# EAGLE design Line_Finder_Card (EAGLE 6.4)

## Sheet 1 of 2
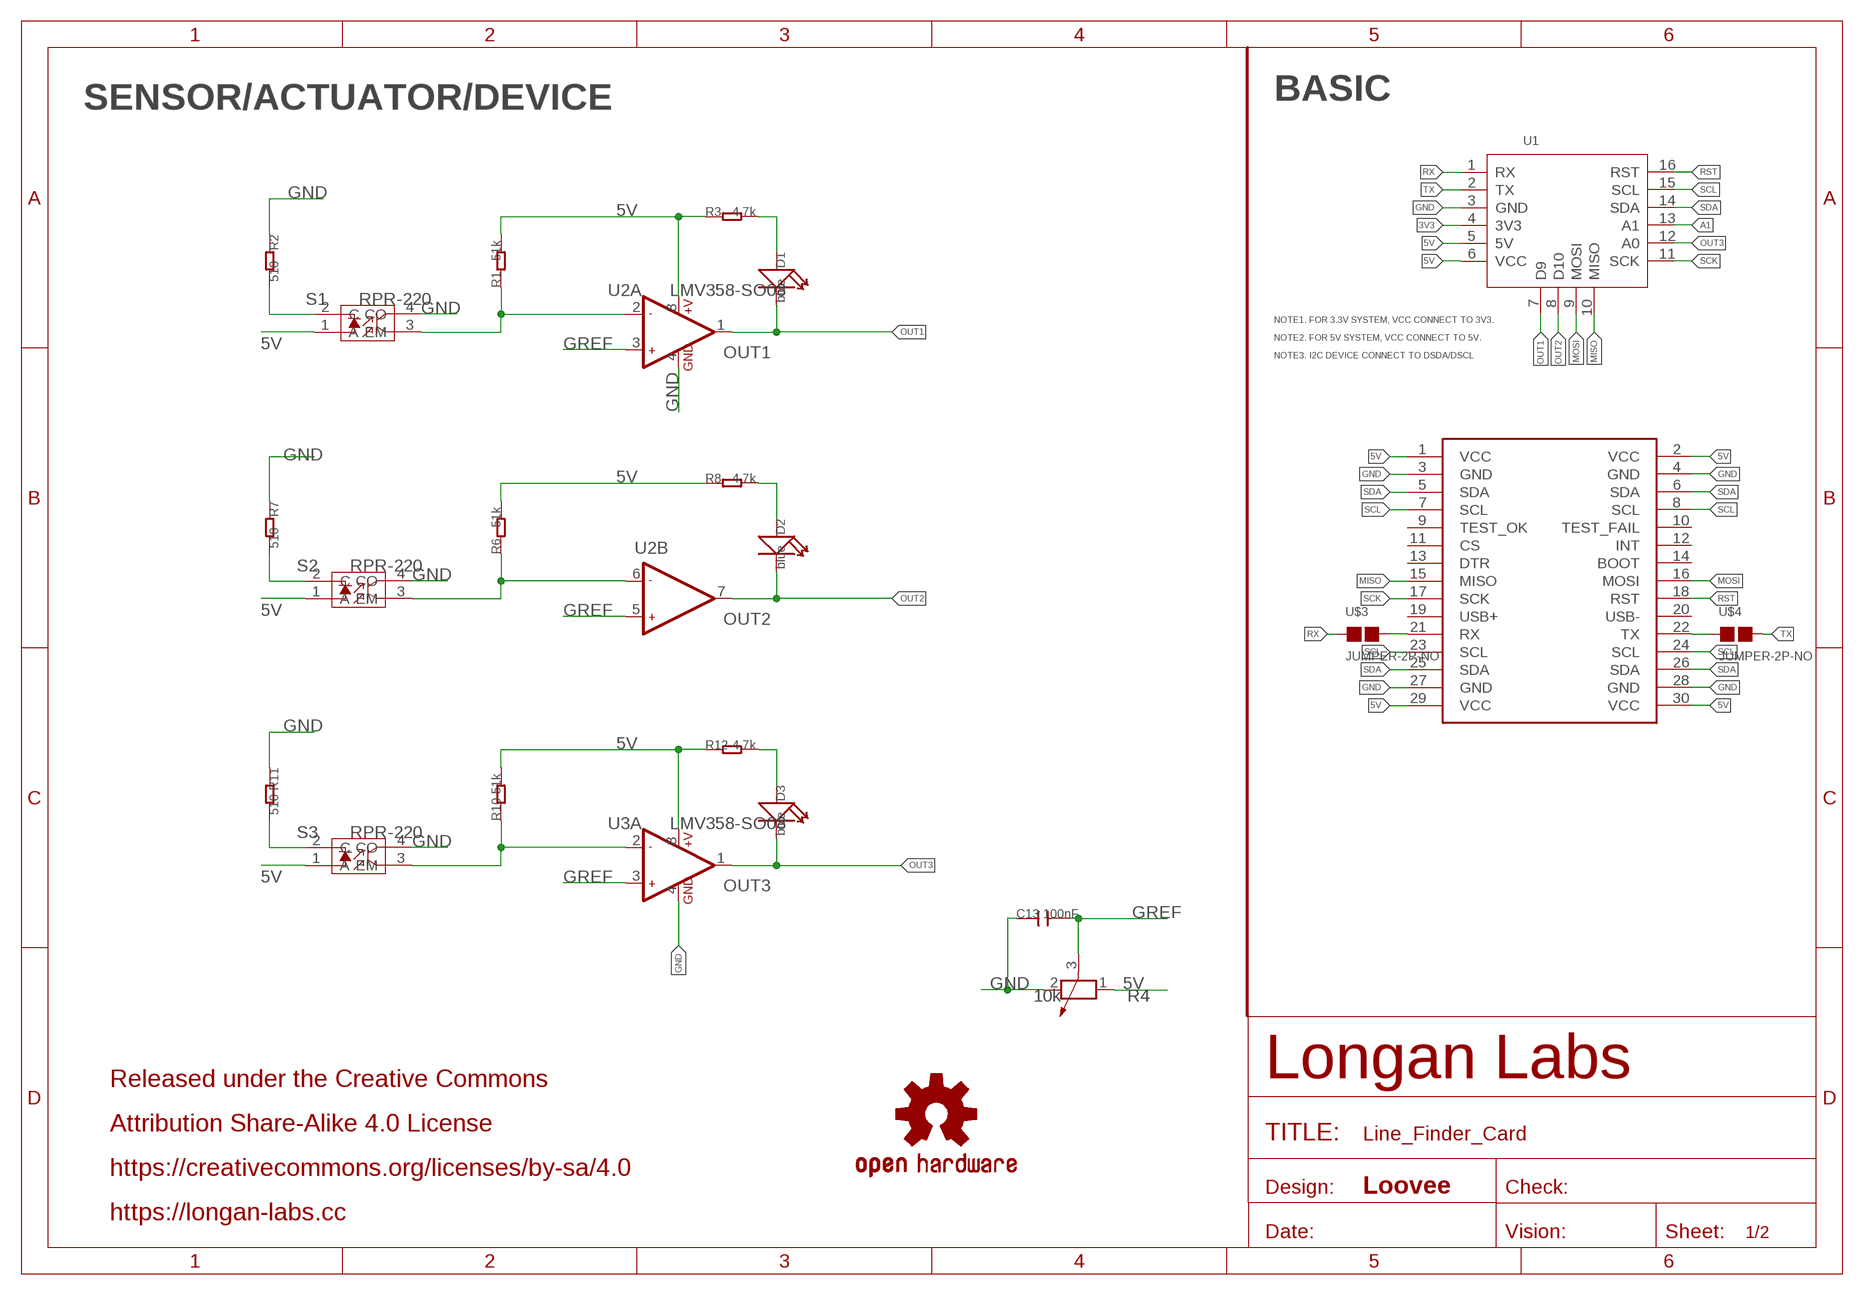
[diagram p0: schematic, sheet 1]

### Parts
C13  100nF  C-0603  [C0603]
D1  blue  LED'0603'  [LED-0603]
D2  blue  LED'0603'  [LED-0603]
D3  blue  LED'0603'  [LED-0603]
LOGO2  OSHW-LOGOS  [OSHW-LOGO-S]
MOUDLE1  MOUDLE-2X15P-2.54'BOARD'  [MOUDLE-2X15P-2.54]
R1  51k  R-0603  [R0603]
R2  510  R-0603  [R0603]
R3  4.7k  R-0603  [R0603]
R4  10k  R-POTENTIOMETER'3362'  [3P-SQUA-7X6.8]
R6  51k  R-0603  [R0603]
R7  510  R-0603  [R0603]
R8  4.7k  R-0603  [R0603]
R10  51k  R-0603  [R0603]
R11  510  R-0603  [R0603]
R12  4.7k  R-0603  [R0603]
S1  RPR-220  REFLECTIVE-PHOTOSENSOR-RPR-220  [4P-6.4X4.9X6.5H]
S2  RPR-220  REFLECTIVE-PHOTOSENSOR-RPR-220  [4P-6.4X4.9X6.5H]
S3  RPR-220  REFLECTIVE-PHOTOSENSOR-RPR-220  [4P-6.4X4.9X6.5H]
U1  MOUDLE-CARDS  [16P-2.0-CARDS]
U2  LMV358-SO08  [SO08]
U3  LMV358-SO08  [SO08]
U$3  JUMPER-2P-NO  [2P-SMD-NO]
U$4  JUMPER-2P-NO  [2P-SMD-NO]

### Nets
3V3: U1.4(3V3)
5V: MOUDLE1.1(VCC) MOUDLE1.2(VCC) MOUDLE1.29(VCC) MOUDLE1.30(VCC) R1.2 R3.1 R4.1 R6.2 R8.1 R10.2 R12.1 S1.1(A) S2.1(A) S3.1(A) U1.5(5V) U1.6(VCC) U2.8(A:+V) U3.8(A:+V)
A1: U1.13(A1)
GND: C13.1 MOUDLE1.3(GND) MOUDLE1.4(GND) MOUDLE1.27(GND) MOUDLE1.28(GND) R2.1 R4.2 R7.1 R11.1 S1.4(CO) S2.4(CO) S3.4(CO) U1.3(GND) U2.4(A:GND) U3.4(A:GND)
GREF: C13.2 R4.3 U2.3(A:+IN1) U2.5(B:+IN2) U3.3(A:+IN1)
MISO: MOUDLE1.15(MISO) U1.10(MISO)
MOSI: MOUDLE1.16(MOSI) U1.9(MOSI)
N$1: MOUDLE1.21(RX) U$3.2
N$2: R1.1 S1.3(EM) U2.2(A:-IN1)
N$3: R6.1 S2.3(EM) U2.6(B:-IN2)
N$4: D2.+ R8.2
N$5: R2.2 S1.2(C)
N$6: R7.2 S2.2(C)
N$7: MOUDLE1.22(TX) U$4.1
N$8: R10.1 S3.3(EM) U3.2(A:-IN1)
N$9: D3.+ R12.2
N$10: R11.2 S3.2(C)
N$12: D1.+ R3.2
OUT1: D1.- U1.7(D9) U2.1(A:OUT1)
OUT2: D2.- U1.8(D10) U2.7(B:OUT2)
OUT3: D3.- U1.12(A0) U3.1(A:OUT1)
RST: MOUDLE1.18(RST) U1.16(RST)
RX: U1.1(RX) U$3.1
SCK: MOUDLE1.17(SCK) U1.11(SCK)
SCL: MOUDLE1.7(SCL) MOUDLE1.8(SCL) MOUDLE1.23(SCL) MOUDLE1.24(SCL) U1.15(SCL)
SDA: MOUDLE1.5(SDA) MOUDLE1.6(SDA) MOUDLE1.25(SDA) MOUDLE1.26(SDA) U1.14(SDA)
TX: U1.2(TX) U$4.2
Unconnected: MOUDLE1.9(TEST_OK) MOUDLE1.10(TEST_FAIL) MOUDLE1.11(CS) MOUDLE1.12(INT) MOUDLE1.13(DTR) MOUDLE1.14(BOOT) MOUDLE1.19(USB+) MOUDLE1.20(USB-) U3.5(B:+IN2) U3.6(B:-IN2) U3.7(B:OUT2)

### Notes on the sheet
- SENSOR/ACTUATOR/DEVICE | BASIC
- NOTE1. FOR 3.3V SYSTEM, VCC CONNECT TO 3V3.
- NOTE2. FOR 5V SYSTEM, VCC CONNECT TO 5V.
- NOTE3. I2C DEVICE CONNECT TO DSDA/DSCL
- Released under the Creative Commons
- Attribution Share-Alike 4.0 License
- https://creativecommons.org/licenses/by-sa/4.0
- Loovee
- https://longan-labs.cc

## Sheet 2 of 2

## Library data of the parts
C13 = Discrete:C*: Ceramic Capacitors
D1-D3 = Discrete:LED*
LOGO2 = SparkFun-Aesthetics:OSHW-LOGO: Open-Source Hardware (OSHW) Logo This logo indicates the piece of hardware it is found on incorporates a OSHW license and/or adheres to the definition of open source hardware found here: http://freedomdefined.org/OSHW
MOUDLE1 = Longan-moudle:MOUDLE-2X15P-2.54
R1-R3 R6-R8 R10-R12 = Discrete:R*
R4 = Discrete:R-POTENTIOMETER*: Potentiometer
S1-S3 = Discrete:REFLECTIVE-PHOTOSENSOR-RPR-220: http://wenku.baidu.com/view/18864e7d27284b73f24250aa.html
U1 = MOUDLE-CARDS:MOUDLE-CARDS
U2 U3 = IC:LMV358: General purpose LOW Voltage, Rail-to-Rail Output Amplifiers http://www.fairchildsemi.com/ds/LM/LMV358.pdf
U$3 U$4 = Discrete-new:JUMPER-2P-NO

## Net classes
0 default: width 0.203 mm, drill 0.254 mm, clearance 0.127 mm

## Board
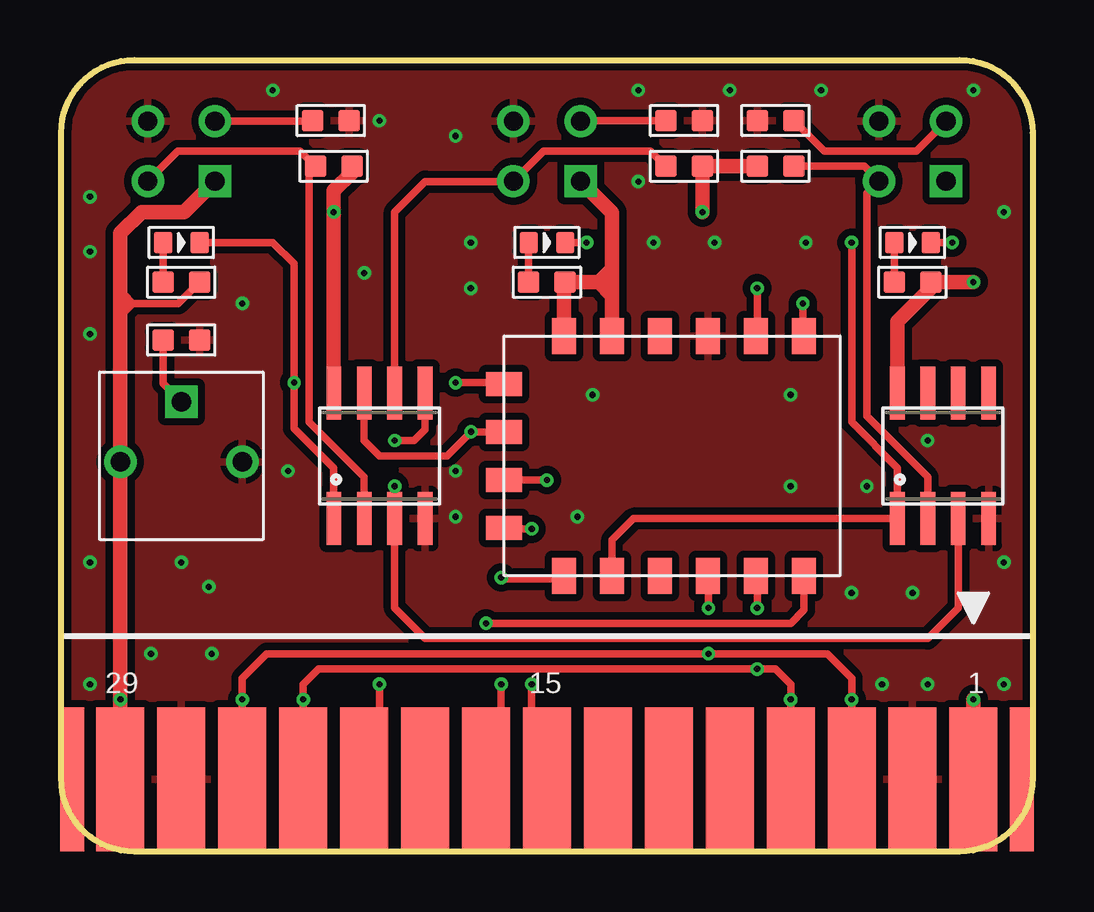
[diagram p1: board, top side]
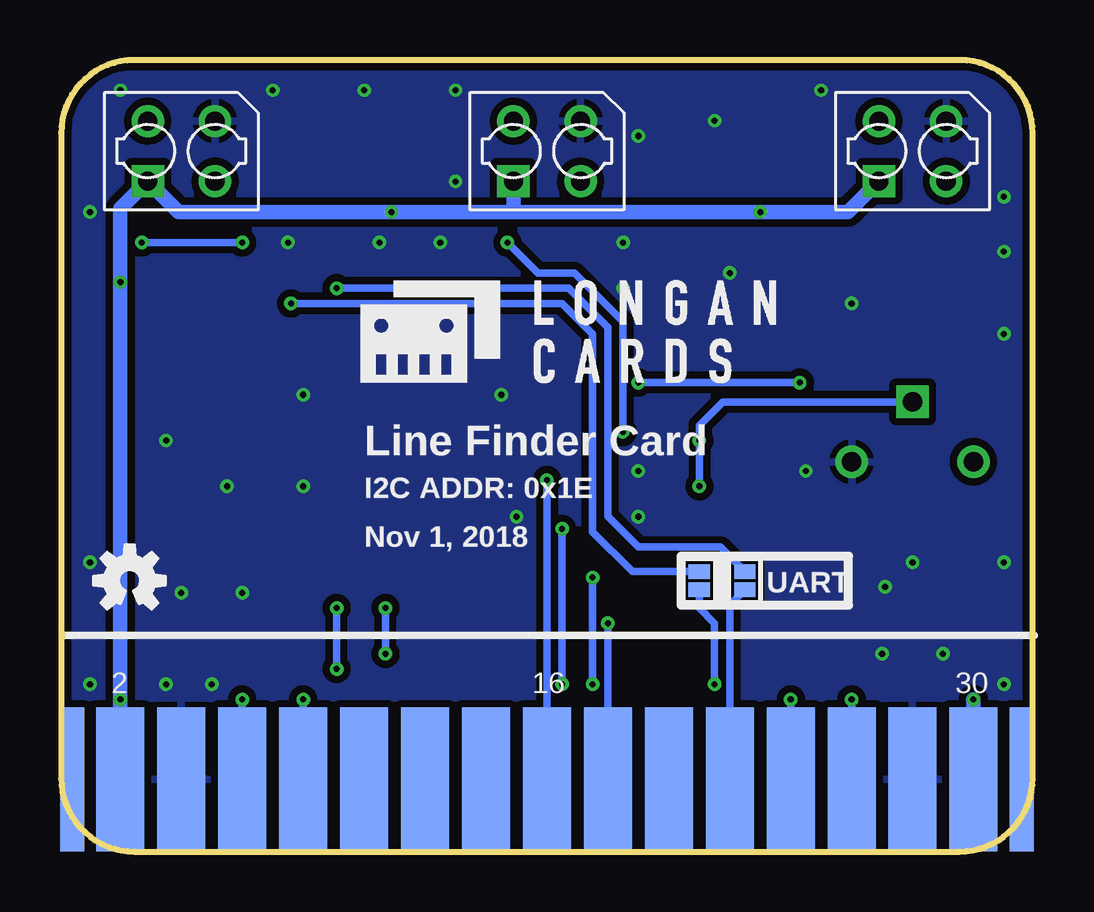
[diagram p2: board, bottom side, seen from below]

Size 40.5 x 33 mm. Coordinates in mm from the lower left corner, seen from the top.
Copper layers (1*16): Top 0.035mm / dielectric 1.5mm / Bottom 0.035mm
Design rules "SeeedStudio_2layer_DRU_no_angle_20140221 *": minimum track width 6mil, minimum drill 10mil, track to track 6mil, track to pad 6mil, pad to pad 6mil, via to via 6mil, smd to smd 0mil, copper to edge 10mil, drill to drill 10mil, minimum pad ring 10mil, minimum via ring 6mil, stop-mask expansion 2mil, vias tented up to drill 25mil, thermal gap 10mil

### Footprints (pad centres in the part's own frame; a part is rotated, then mirrored left to right if it is on the bottom)
C0603 = smd 0.889 x 0.889: 1 -0.762,0; 2 0.762,0
LED-0603 = smd 0.762 x 0.889: + -0.762,0; - 0.762,0
MOUDLE-2X15P-2.54 = smd 2 x 6: 1 17.78,-13.492; 3 15.24,-13.492; 5 12.7,-13.492; 7 10.16,-13.492; 9 7.62,-13.492; 11 5.08,-13.492; 13 2.54,-13.492; 15 0,-13.492; 17 -2.54,-13.492; 19 -5.08,-13.492; 21 -7.62,-13.492; 23 -10.16,-13.492; 25 -12.7,-13.492; 27 -15.24,-13.492; 29 -17.78,-13.492 | smd 2 x 6 bottom: 2 17.78,-13.492; 4 15.24,-13.492; 6 12.7,-13.492; 8 10.16,-13.492; 10 7.62,-13.492; 12 5.08,-13.492; 14 2.54,-13.492; 16 0,-13.492; 18 -2.54,-13.492; 20 -5.08,-13.492; 22 -7.62,-13.492; 24 -10.16,-13.492; 26 -12.7,-13.492; 28 -15.24,-13.492; 30 -17.78,-13.492 | smd 1 x 6: P1 -19.8,-13.492; P4 19.8,-13.492 | smd 1 x 6 bottom: P2 -19.8,-13.492; P3 19.8,-13.492
R0603 = smd 0.889 x 0.889: 1 -0.762,0; 2 0.762,0
3P-SQUA-7X6.8 = drill 0.8 pad 1.35: 1 -2.54,-0.25; 2 2.54,-0.25 | drill 0.8 pad 1.35 square: 3 0,2.25
4P-6.4X4.9X6.5H = drill 0.8 pad 1.35 square: 1 -1.4,-1.25 | drill 0.8 pad 1.35: 2 -1.4,1.25; 3 1.4,-1.25; 4 1.4,1.25
16P-2.0-CARDS = smd 1.5 x 1: 1 -5,5; 2 -5,3; 3 -5,1; 4 -5,-1; 5 -5,-3; 6 -5,-5; 11 5,-5; 12 5,-3; 13 5,-1; 14 5,1; 15 5,3; 16 5,5 | smd 1 x 1.5: 7 -3,-7.5; 8 -1,-7.5; 9 1,-7.5; 10 3,-7.5
SO08 = smd 0.61 x 2.21: 1 -1.905,-2.616; 2 -0.635,-2.616; 3 0.635,-2.616; 4 1.905,-2.616; 5 1.905,2.616; 6 0.635,2.616; 7 -0.635,2.616; 8 -1.905,2.616
2P-SMD-NO = smd 0.889 x 0.61: 1 0,0.381; 2 0,-0.381

### Placement (x,y rotation side)
C13  5.01,21.33 180 top
D1  5.01,25.39 0 top
D2  20.25,25.39 0 top
D3  35.49,25.39 0 top
LOGO2  37.65,11.29 0 bottom
MOUDLE1  20.25,16.5 0 top
R1  11.36,28.56 0 top
R2  11.23,30.47 180 top
R3  5.01,23.74 180 top
R4  5.01,16.5 0 top
R6  25.96,28.56 0 top
R7  25.96,30.47 180 top
R8  20.25,23.74 180 top
R10  29.77,28.56 180 top
R11  29.77,30.47 0 top
R12  35.49,23.74 180 top
S1  5.01,29.2 0 bottom
S2  20.25,29.2 0 bottom
S3  35.49,29.2 0 bottom
U1  25.96,16.5 270 top
U2  13.27,16.5 0 top
U3  36.76,16.5 0 top
U$1  [LONGAN-CARDS-MIDDLE]  28.76,19.04 0 bottom
U$3  13.9,11.29 0 bottom
U$4  11.99,11.29 180 bottom

### Tracks (layer width: path | path; a pad name or v marks a point on that pad's centre or on a via)
5V  (via drill 0.25 pad 0.51)
  Top 0.305: R3.1 4.88,22.85 2.98,22.85 | 2.98,22.85 2.6,22.85 2.47,22.98 | 2.98,22.85 2.6,23.23 | 2.98,22.85 2.6,22.47
  Top 0.61: U3.8 34.86,22.09 36.25,23.48 R12.1 v38.03,23.74 | MOUDLE1.30 v2.47,6.34 R4.1 2.47,22.98 2.47,25.77 3.36,26.66 5.12,26.66 S1.1 | v38.03,6.34 MOUDLE1.2 | U2.8 v11.36,26.66 11.36,27.55 12.12,28.31 R1.2 | R10.2 R6.2 v26.73,26.66 | U1.6 20.96,23.69 R8.1 22.41,23.74 | 22.41,23.74 22.96,23.18 U1.5 22.96,26.63 S2.1 | 22.41,23.74 22.92,24.25
  Bottom 0.61: v2.47,6.34 2.47,3.67 2.34,3.55 2.34,3.13 MOUDLE1.30 | MOUDLE1.2 v38.03,6.34 38.03,22.72 v38.03,23.74 38.03,26.81 S3.1 35.6,26.66 v26.73,26.66 21.52,26.66 | 21.52,26.66 v11.36,26.66 7.7,26.66 S1.1 | S2.1 21.65,26.79 21.52,26.66
GND  (via drill 0.25 pad 0.51)
  other vias: 34.22,6.97 36.12,6.97 39.3,6.97 3.74,8.24 9.46,15.87 1.2,6.97 32.95,10.79 39.3,12.05 7.55,22.85 1.2,25.01 16.44,15.87 16.44,13.96 17.07,23.48 27.87,31.74 31.68,31.74 39.3,26.66 35.49,10.79 21.52,13.96 22.16,19.04 30.41,19.04 33.59,15.23 36.12,17.14 27.23,25.39 1.2,27.3 8.82,31.74 38.03,31.74 30.41,15.23 6.28,8.24 6.15,11.04 5.01,12.05 1.2,12.05 1.2,21.58 12.63,24.12 13.27,30.47 16.44,29.84 17.07,25.39 31.05,25.39 24.7,25.39 24.06,27.93 24.06,31.74
  pour Top (isolate 0.305): -0.07,33.01 40.57,33.01 40.57,-0.01 -0.07,-0.01
  pour Bottom (isolate 0.305): -0.07,33.01 40.57,33.01 40.57,-0.01 -0.07,-0.01
GREF  (via drill 0.25 pad 0.51)
  Top 0.305: U3.3 37.39,10.15 36.12,8.88 15.17,8.88 13.9,10.15 U2.3 v13.9,15.23 | C13.2 4.25,19.51 R4.3 | U2.5 15.17,17.59 14.71,17.14 v13.9,17.14
  Bottom 0.305: v13.9,15.23 v13.9,17.14 13.9,17.77 12.92,18.75 R4.3
MISO  (via drill 0.25 pad 0.51)
  Top 0.305: 18.93,13.37 U1.10 18.51,13.45 v19.61,13.45 | v19.61,6.97 19.61,3.64 MOUDLE1.15
  Bottom 0.305: v19.61,13.45 v19.61,6.97
MOSI  (via drill 0.25 pad 0.51)
  Top 0.305: v20.25,15.48 18.48,15.48 U1.9
  Bottom 0.305: v20.25,15.48 MOUDLE1.16
N$1  (via drill 0.25 pad 0.51)
  Top 0.305: MOUDLE1.21 12.63,3.16 13.27,3.8 v13.27,6.97
  Bottom 0.305: v13.27,6.97 13.27,9.52 13.9,10.15 U$3.2
N$2
  Top 0.305: U2.2 12.63,15.61 10.34,17.9 10.34,28.31 R1.1 9.96,29.2 4.86,29.2 S1.3
N$3
  Top 0.305: U2.6 13.9,26.66 15.17,27.93 18.83,27.93 S2.3 20.1,29.2 24.57,29.2 R6.1
N$4
  Top 0.305: D2.+ R8.2
N$5
  Top 0.305: S1.2 10.45,30.45 R2.2
N$6
  Top 0.305: R7.2 21.67,30.47 S2.2
N$7
  Bottom 0.305: MOUDLE1.22 12.63,10.28 U$4.1
N$8
  Top 0.305: U3.2 36.12,15.61 33.59,18.15 33.59,27.45 S3.3 33.48,28.56 R10.1
N$9
  Top 0.305: D3.+ R12.2
N$10
  Top 0.305: R11.2 31.81,29.2 35.64,29.2 S3.2
N$12
  Top 0.305: R3.2 D1.+
OUT1  (via drill 0.25 pad 0.51)
  Top 0.305: U2.1 11.36,15.99 9.71,17.64 v9.71,19.55 9.71,24.5 8.82,25.39 D1.- | v16.44,19.55 18.42,19.55 U1.7
  Bottom 0.305: v9.71,19.55 v16.44,19.55
OUT2  (via drill 0.25 pad 0.51)
  Top 0.305: U2.7 12.63,17.14 13.27,16.5 16.08,16.5 v17.08,17.5 U1.8 | v21.9,25.39 D2.-
  Bottom 0.305: v17.08,17.5 17.08,22.1 19.11,24.12 20.63,24.12 v21.9,25.39
OUT3  (via drill 0.25 pad 0.51)
  Top 0.305: U1.12 22.96,12.99 23.86,13.88 U3.1 34.86,15.99 32.95,17.9 v32.95,25.39 | v37.14,25.39 D3.-
  Bottom 0.305: v32.95,25.39 v37.14,25.39
RST  (via drill 0.25 pad 0.51)
  Top 0.305: v17.71,9.52 30.41,9.52 30.96,10.07 U1.16
  Bottom 0.305: v17.71,9.52 MOUDLE1.18
RX  (via drill 0.25 pad 0.51)
  Top 0.305: v30.92,22.85 30.92,21.55 U1.1
  Bottom 0.305: v30.92,22.85 19.61,22.85 18.34,21.58 18.34,13.32 16.69,11.67 U$3.1
SCK  (via drill 0.25 pad 0.51)
  Top 0.305: v18.34,11.42 18.39,11.37 20.84,11.37 U1.11 | v18.34,6.97 18.34,3.64 MOUDLE1.17
  Bottom 0.305: v18.34,11.42 v18.34,6.97
SCL  (via drill 0.25 pad 0.51)
  Top 0.305: MOUDLE1.8 v30.41,6.34 30.41,6.97 29.77,7.61 v29.01,7.61 10.72,7.61 10.09,6.97 v10.09,6.34 MOUDLE1.23 | v29.01,10.15 29.01,11.45 U1.15
  Bottom 0.305: v10.09,6.34 MOUDLE1.23 | v30.41,6.34 MOUDLE1.8 | v29.01,7.61 v29.01,10.15
SDA  (via drill 0.25 pad 0.51)
  Top 0.305: MOUDLE1.6 v32.95,6.34 32.95,7.23 31.93,8.24 v26.98,8.24 8.57,8.24 7.55,7.23 v7.55,6.34 MOUDLE1.25 | v26.98,10.15 26.98,11.48 U1.14
  Bottom 0.305: v7.55,6.34 MOUDLE1.25 | v32.95,6.34 MOUDLE1.6 | v26.98,8.24 v26.98,10.15
TX  (via drill 0.25 pad 0.51)
  Top 0.305: v29.01,23.48 29.01,21.55 U1.2
  Bottom 0.305: v29.01,23.48 19.36,23.48 17.71,21.83 17.71,13.96 16.44,12.69 13.01,12.69 U$4.2

### Text on the board
bPlace: Line Finder Card | I2C ADDR: 0x1E | Nov 1, 2018 | UART